# EAGLE design lightmeter_seeed1 (EAGLE 7.1.0)
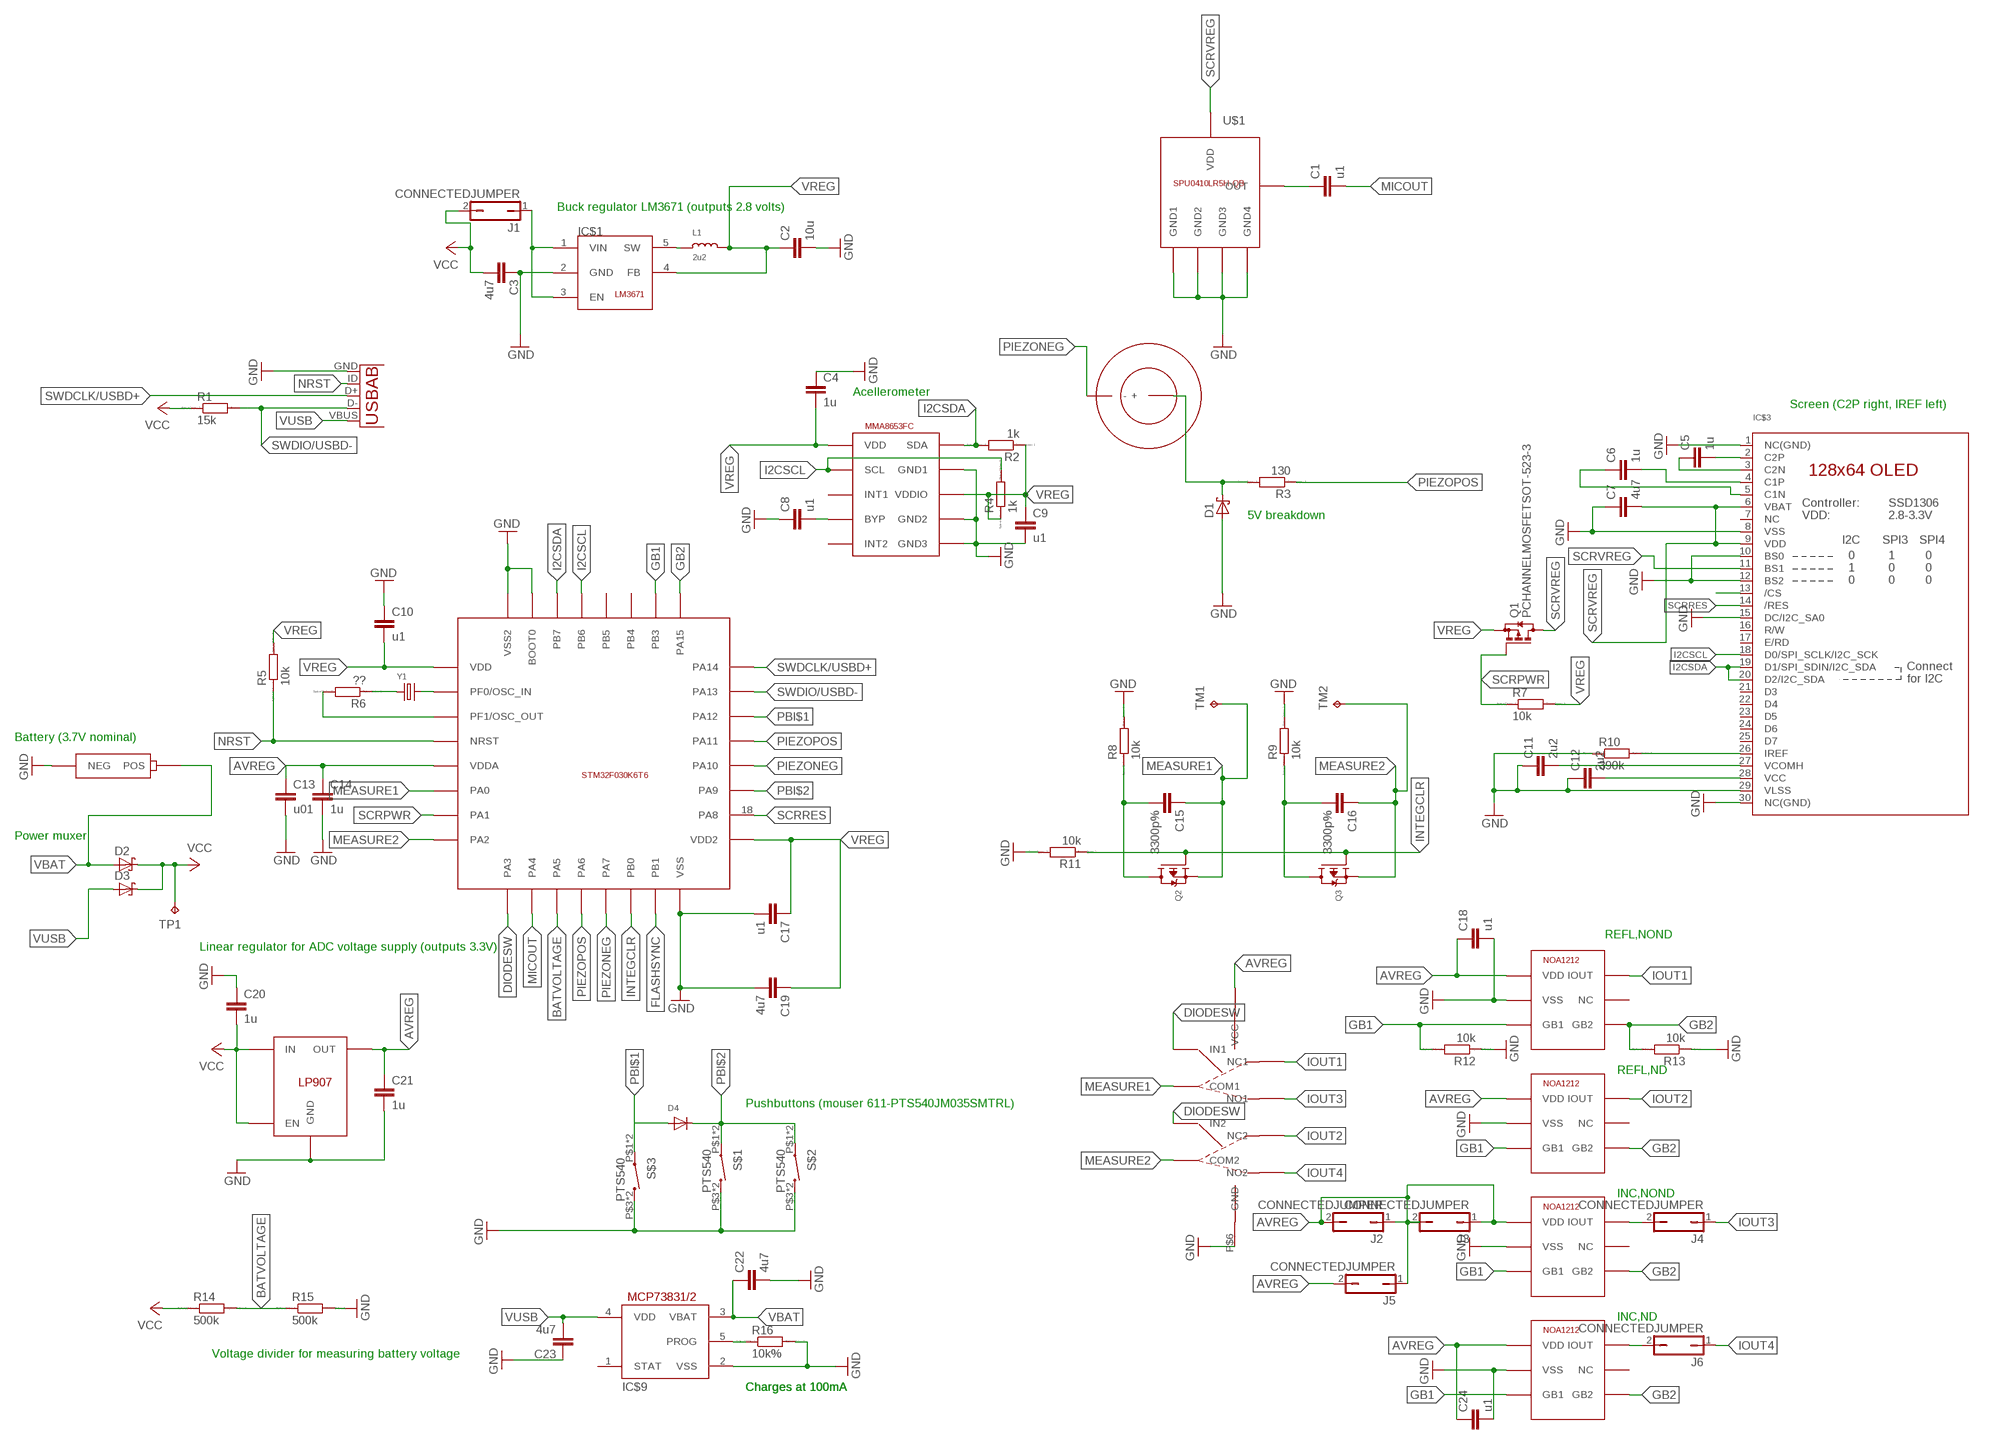
[diagram p0: schematic, sheet 1]

## Parts
C1  u1  C-EUC0402  [C0402]
C2  10u  C-EUC0402  [C0402]
C3  4u7  C-EUC0402  [C0402]
C4  1u  C-EUC0603  [C0603]
C5  1u  C-EUC0603  [C0603]
C6  1u  C-EUC0603  [C0603]
C7  4u7  C-EUC0402  [C0402]
C8  u1  C-EUC0603  [C0603]
C9  u1  C-EUC0402  [C0402]
C10  u1  C-EUC0402  [C0402]
C11  2u2  C-EUC0402  [C0402]
C12  2u2  C-EUC0402  [C0402]
C13  u01  CGAP0402  [GAP0402]
C14  1u  CGAP0402  [GAP0402]
C15  3300p%  C-EUC0603  [C0603]
C16  3300p%  C-EUC0603  [C0603]
C17  u1  C-EUC0402  [C0402]
C18  u1  C-EUC0402  [C0402]
C19  4u7  C-EUC0402  [C0402]
C20  1u  C-EUC0603  [C0603]
C21  1u  C-EUC0402  [C0402]
C22  4u7  C-EUC0402  [C0402]
C23  4u7  C-EUC0402  [C0402]
C24  u1  C-EUC0402  [C0402]
D1  SCHOTTKY-DIODESOD-929  [SOD-923]
D2  SCHOTTKY-DIODEX3-DFN0603-2  [X3-DFN0603-2]
D3  SCHOTTKY-DIODEX3-DFN0603-2  [X3-DFN0603-2]
D4  DIODESOD-323F  [SOD-323F]
IC$1  LM3671  [SOT23-5]
IC$2  MMA8653  [DFN-10]
IC$3  DISP_OLED_UG-2864HSWEG010.96"  [UG-2864HSWEG01_0.96IN_WRAPAROUND]
IC$4  STM32F030K6T6  [QFP-32]
IC$5  NOA1212  [CUDFN6]
IC$6  LP5907  [SOT23-5L]
IC$7  NOA1212  [CUDFN6]
IC$8  NOA1212  [CUDFN6]
IC$9  MCP73831/OT  [SOT23-5L]
IC$10  NOA1212  [CUDFN6]
J1  CONNECTEDJUMPER  [JUMPER_R0402]
J2  CONNECTEDJUMPER  [JUMPER_R0402]
J3  CONNECTEDJUMPER  [JUMPER_R0402]
J4  CONNECTEDJUMPER  [JUMPER_R0402]
J5  CONNECTEDJUMPER  [JUMPER_R0402]
J6  CONNECTEDJUMPER  [JUMPER_R0402]
L1  2u2  INDUCTOR_0603  [_0603]
Q1  PCHANNELMOSFETSOT-523-3  [SOT-523-3]
Q2  MOSFET-PWIDE  [SOT23-WIDE]
Q3  MOSFET-PWIDE  [SOT23-WIDE]
R1  15k  R-EU_R0402  [R0402]
R2  1k  R-EU_R0402  [R0402]
R3  130  R-EU_R0603  [R0603]
R4  1k  R-EU_R0402  [R0402]
R5  10k  R-EU_R0402  [R0402]
R6  ??  R-EU_R0402  [R0402]
R7  10k  R-EU_R0402  [R0402]
R8  10k  R-EU_R0402  [R0402]
R9  10k  R-EU_R0402  [R0402]
R10  390k  R-EU_R0402  [R0402]
R11  10k  R-EU_R0402  [R0402]
R12  10k  R-EU_R0402  [R0402]
R13  10k  R-EU_R0402  [R0402]
R14  500k  R-EU_R0402  [R0402]
R15  500k  R-EU_R0402  [R0402]
R16  10k%  R-EU_R0402  [R0402]
S$1  PTS540  [PTS540BTM]
S$2  PTS540  [PTS540BTM]
S$3  PTS540  [PTS540BTM]
TM1  TPB1,27  [B1,27]
TM2  TPB1,27  [B1,27]
TP1  TPB1,27  [B1,27]
U1  USB-ABUSB-AB-MICRO-MIDMOUNT  [USB-AB-MICRO-MIDMOUNT]
U$1  SPU0410LR5H-QBSPU0410LRSH-QB  [SPU0410LR5H-QB]
U$2  PIEZOBENDER165  [PIEZOBENDER165]
U$3  LIBAT  [78171-0002]
U$4  NLAS5223B  [WQFN10]
Y1  CRYSTAL2.5X2.0MM  [CRYSTAL_2.5X2]

## Nets
AUDIOIN: D1.P$2(C) R3.2 U$2.P$2(+)
AVREG: C13.1 C14.1 C18.1 C21.1 C24.1 IC$4.5(VDDA) IC$5.P$1(VDD) IC$6.5(OUT) IC$7.P$1(VDD) IC$8.P$1(VDD) IC$10.P$1(VDD) J2.1 J2.2 J3.1 J3.2 J5.1 J5.2 U$4.P$1(VCC)
BATVOLTAGE: IC$4.11(PA5) R14.2 R15.1
DIODESW: IC$4.9(PA3) U$4.P$4(IN1) U$4.P$8(IN2)
FLASHSYNC: IC$4.15(PB1)
GB1: IC$4.26(PB3) IC$5.P$3(GB1) IC$7.P$3(GB1) IC$8.P$3(GB1) IC$10.P$3(GB1) R12.2
GB2: IC$4.25(PA15) IC$5.P$4(GB2) IC$7.P$4(GB2) IC$8.P$4(GB2) IC$10.P$4(GB2) R13.2
GND: C2.2 C3.1 C4.1 C7.1 C8.1 C9.2 C10.1 C11.1 C12.1 C13.2 C14.2 C17.2 C18.2 C19.2 C20.1 C21.2 C22.2 C23.1 C24.2 D1.P$1(A) IC$1.2(GND) IC$2.P$6(GND3) IC$2.P$7(GND2) IC$2.P$9(GND1) IC$3.1(NC(GND)) IC$3.8(VSS) IC$3.10(BS0) IC$3.12(BS2) IC$3.15(DC/I2C_SA0) IC$3.29(VLSS) IC$3.30(NC(GND)) IC$4.16(VSS) IC$4.31(BOOT0) IC$4.32(VSS2) IC$5.P$2(VSS) IC$5.P$7(VSS) IC$6.2(GND) IC$7.P$2(VSS) IC$7.P$7(VSS) IC$8.P$2(VSS) IC$8.P$7(VSS) IC$9.2(VSS) IC$10.P$2(VSS) IC$10.P$7(VSS) R8.2 R9.2 R10.1 R11.2 R12.1 R13.1 R15.2 R16.2 S$1.P$3 S$1.P$4 S$2.P$3 S$2.P$4 S$3.P$3 S$3.P$4 U1.GND U$1.P$2(GND1) U$1.P$3(GND2) U$1.P$5(GND3) U$1.P$6(GND4) U$3.P$1(NEG) U$4.P$6(GND)
I2CSCL: IC$2.P$2(SCL) IC$3.18(D0/SPI_SCLK/I2C_SCK) IC$4.29(PB6) R4.2
I2CSDA: IC$2.P$10(SDA) IC$3.19(D1/SPI_SDIN/I2C_SDA) IC$3.20(D2/I2C_SDA) IC$4.30(PB7) R2.2
INTEGCLR: IC$4.14(PB0) Q2.1(G) Q3.1(G) R11.1
IOUT1: IC$5.P$6(IOUT) U$4.P$5(NC1)
IOUT2: IC$7.P$6(IOUT) U$4.P$7(NC2)
IOUT3: J4.1 U$4.P$2(NO1)
IOUT4: J6.1 U$4.P$10(NO2)
MEASURE1: C15.1 IC$4.6(PA0) Q2.2(S) TM1.TP U$4.P$3(COM1)
MEASURE2: C16.1 IC$4.8(PA2) Q3.2(S) TM2.TP U$4.P$9(COM2)
MICOUT: C1.2 IC$4.10(PA4)
N$1: IC$8.P$6(IOUT) J4.2
N$2: IC$10.P$6(IOUT) J6.2
N$3: C15.2 Q2.3(D) R8.1
N$4: IC$1.1(VIN) IC$1.3(EN) J1.1
N$5: IC$9.5(PROG) R16.1
N$6: C16.2 Q3.3(D) R9.1
N$7: C8.2 IC$2.P$4(BYP)
N$8: IC$4.2(PF0/OSC_IN) Y1.3
N$9: IC$4.3(PF1/OSC_OUT) R6.2
N$10: IC$1.5(SW) L1.1
N$11: R6.1 Y1.1
N$12: C11.2 IC$3.27(VCOMH)
N$14: C1.1 U$1.P$1(OUT)
N$15: C5.2 IC$3.2(C2P)
N$16: C5.1 IC$3.3(C2N)
N$19: IC$3.26(IREF) R10.2
N$24: C6.1 IC$3.5(C1N)
N$27: C6.2 IC$3.4(C1P)
N$30: C12.2 IC$3.28(VCC)
NRST: IC$4.4(NRST) R5.1 U1.ID(USBID)
PBI$1: D4.A IC$4.22(PA12) S$3.P$1 S$3.P$2
PBI$2: D4.C IC$4.19(PA9) S$1.P$1 S$1.P$2 S$2.P$1 S$2.P$2
PIEZONEG: IC$4.13(PA7) IC$4.20(PA10) U$2.P$1(-)
PIEZOPOS: IC$4.12(PA6) IC$4.21(PA11) R3.1
SCRCS: IC$3.13(/CS)
SCRPWR: IC$4.7(PA1) Q1.P$2(G) R7.1
SCRRES: IC$3.14(/RES) IC$4.18(PA8)
SCRVREG: C7.2 IC$3.6(VBAT) IC$3.9(VDD) IC$3.11(BS1) Q1.P$1(D) U$1.P$4(VDD)
SWDCLK/USBD+: IC$4.24(PA14) U1.D+
SWDIO/USBD-: IC$4.23(PA13) R1.2 U1.D-
VBAT: C22.1 D2.P$1(A) IC$9.3(VBAT) U$3.P$2(POS)
VCC: C3.2 C20.2 D2.P$2(C) D3.P$2(C) IC$6.1(IN) IC$6.3(EN) J1.2 R1.1 R14.1 TP1.TP
VREG: C2.1 C4.2 C9.1 C10.2 C17.1 C19.1 IC$1.4(FB) IC$2.P$1(VDD) IC$2.P$8(VDDIO) IC$4.1(VDD) IC$4.17(VDD2) L1.2 Q1.P$3(S) R2.1 R4.1 R5.2 R7.2
VUSB: C23.2 D3.P$1(A) IC$9.4(VDD) U1.VBUS
Unconnected: IC$2.P$3(INT1) IC$2.P$5(INT2) IC$3.7(NC) IC$3.16(R/W) IC$3.17(E/RD) IC$3.21(D3) IC$3.22(D4) IC$3.23(D5) IC$3.24(D6) IC$3.25(D7) IC$4.27(PB4) IC$4.28(PB5) IC$5.P$5(NC) IC$7.P$5(NC) IC$8.P$5(NC) IC$9.1(STAT) IC$10.P$5(NC)

## Notes on the sheet
- Buck regulator LM3671 (outputs 2.8 volts)
- Acellerometer
- Screen (C2P right, IREF left)
- 5V breakdown
- Battery (3.7V nominal)
- Power muxer
- REFL,NOND
- Linear regulator for ADC voltage supply (outputs 3.3V)
- REFL,ND
- Pushbuttons (mouser 611-PTS540JM035SMTRL)
- INC,NOND
- INC,ND
- Voltage divider for measuring battery voltage
- Charges at 100mA | Charges at 100mA

## Library data of the parts
C1-C12 C15-C24 = rcl:C-EU: CAPACITOR, European symbol
C13 C14 = lightmeter:C: CAPACITOR naming: grid - package width
D1-D3 = lightmeter:SCHOTTKY-DIODE: Schottky Diode
D4 = adafruit:DIODE: Diode SMADIODE - SMA Surface Mount Package 20V 1A Schottky Diode Digikey: 641-1014-6-ND DO-1N4148 - Through Hole Small Current Diode SOD-123 20V 1 A (.5mV Vf) Schottky Diode - Digikey: MBRX120TPMSCT-ND SOD-323 10V 570mA (.38mV Vf, 3ns) Schottky Diode - Digikey: ZLLS410CT-ND SOD-523 30V 30mA Schottky Diode (RB751S-40TE61) - Digikey: RB751S-40TE61CT-ND SOT23-R/W - SOT23 Package (R = Solder Paste/Reflow Ovens, W = Hand-Soldering) BAT54Film 40V 300mA - Digikey: 497-7162-1-ND
IC$1 = lightmeter:LM3671
IC$2 = lightmeter:MMA8653
IC$3 = microbuilder:DISP_OLED_UG-2864HSWEG01: UG-2864HSWEG01 OLED display Both 1.3" and 0.96" models share the same FPC tab footprint, only the screen dimensions vary.
IC$4 = lightmeter:STM32F030K6T6
IC$5 IC$7 IC$8 IC$10 = lightmeter:NOA1212
IC$6 = lightmeter:LP5907
IC$9 = adafruit:MCP73831: MCP73831/2 Miniature Single-Cell, Fully Integrated Li-Ion, Li-Polymer Charge Management Controllers. Nice and small simple lipoly charge controller, with adjustable current and status output (LED) http://www.ladyada.net/library/pcb/eaglelibrary.html
J1-J6 = lightmeter:CONNECTEDJUMPER
L1 = microbuilder:INDUCTOR: Inductors 0603: 10nH Ceramic Inductor - microwire antenna/RF (Digikey: 712-1434-2-ND) 0805: 560nH Ceramic Inductor - RF (Digikey: 553-1047-1-ND) 270nH Ceramic Inductor - Q = 40@250MHz, +-5%, 1 Ohm DC Resistance (Digikey: 535-10506-2-ND) 1007 (2518 Metric) SMT: 10µH 10% 250mOhm 820mA 1007 Inductor (Digikey: 587-2189-1-ND) 22µH 10% 500mOhm 580mA 1007 Inductor (Digikey: 587-2190-1-ND) 47µH 10% 950mOhm 420mA 1007 Inductor (Digikey: 587-2191-1-ND) 47µH 5% 100mOhm 1A 1008 Inductor (Digikey: 732-1816-1-ND) 5.0x5.0mm (Taiyo Yuden NR5040 Series) 6.8µH 20% 2.3A 64mOhm Inductor (Digikey: 587-2374-2-ND) 5.0x5.0mm (TDK VLC5045 Series) 4.7µH 20% 3.3A 34mOhm Inductor (Digikey: 445-6526-1-ND) 6.8µH 20% 2.7A 46mOhm Inductor (Digikey: 445-6527-1-ND) 6.0x6.0mm (TDK VLC6045 Series) 4.7µH 20% 3.8A 27mOhm Inductor (Digikey: 445-6538-2-ND) 6.8µH 20% 3A 41mOhm Inductor (Digikey: 445-6540-1-ND) 6.2µH 30% 2.2A 45mOhm Inductor (Digikey: SRR5028-6R2YCT-ND) - Not TDK VLC6045 but footprint should match 6.0x6.0mm (TDK SLF6045 Series) 6.8uH 30% 2A 33mOhm Inductor (Digikey: 445-4572-1-ND, Mouser: 810-SLF645T6R8N2R0PF)
Q1 = lightmeter:PCHANNELMOSFET
Q2 Q3 = microbuilder:MOSFET-P: P-Channel Mosfet LEGEND VDS: Voltage Drain-Source ID: Drain Current RDS(ON): Drain-Source On-State Resistance VGS(TH): Gate-Source Threshold Voltage CISS: Drain-Source Input Capacitance SOT-23 Name VDS ID RDS(ON) VGS(TH) CISS Order Number IRLML5103 30V 760mA 600 mOhm -- 75pF @ 25V Digikey: IRLML5103PBFCT-ND IRLML6401 12V 4.3A 50 mOhm 950mV @ 250µA 830pF @ 10V Digikey: IRLML6401PBFTR-ND NTR0202PL 20V 400mA 800 mOhm 2.3V @ 250uA 70pF @ 5V Digikey: NTR0202PLT1GOSTR-ND NTR4101PT1G 20V 1.8A 85 mOhm 1.2V @ 250uA 675pF @ 10V Digikey: NTR4101PT1GOSCT-ND DMP2004K 20V 600mA 900 mOhm 1V @ 250uA 175pF @ 16V Digikey: DMP2004KDICT-ND PMV65XP 20V 3.9A 76 mOhm 950mV @ 1mA 725pF @ 20V Digikey: 568-2358-2-ND TO-252 Name VDS ID RDS(ON) VGS(TH) CISS Order Number AOD417 30V 25A 34 mOhm 3V @ 250µA 920pF @ 15V Digikey: 785-1106-2-ND
R1-R16 = resistor:R-EU_: RESISTOR, European symbol; SPICEPREFIX: R
S$1-S$3 = lightmeter:PTS540
TM1 TM2 TP1 = testpad:TP: Test pad
U1 = lightmeter:USB-AB: This is a USB AB connector that is compatible with USB OTG. i.e. this connector can serve as a host or device
U$1 = lightmeter:SPU0410LR5H-QB
U$2 = lightmeter:PIEZOBENDER165
U$3 = lightmeter:LIBAT
U$4 = lightmeter:NLAS5223B
Y1 = microbuilder:CRYSTAL: Crystals HC49UP - Surface Mount Crystal 4.0MHz 18pF +/-30ppm Surface Mount Crystal [Digikey: 535-9857-1-ND] 12.0 MHz Surface Mount Crystal [Digikey: 535-9869-6-ND] 25.0 MHz Surface Mount Crystal [Digikey: 535-9078-1-ND] 2.5 x 2.0mm - MEMs SMT Crystal 16.0 MHz 10pF 20ppm 2.5 x 2.0mm Crystal [Digikey -40-85°C: 535-10923-1-ND] 3.2 x 2.5mm - MEMs SMT Crystal 12.0 MHz 8pF 15ppm 3.2 x 2.5mm Crystal [Digikey: -10-70°C: 644-1047-1-ND -40-125°C: 644-1128-1-ND] 16.0 MHz 8pF 15ppm 3.2 x 2.5mm Crystal [Digikey: -10-70°C: 644-1049-1-ND -40-125°C: 644-1129-2-ND] 16.0 MHz 10pF 10ppm 3.2 x 2.5mm Crystal [Digikey: 644-1100-1-ND] 27.12 MHz 18pF 30ppm 3.2 x 2.5mm Crystal [Digikey: 887-1424-1-ND] 27.12MHz 10pF 10ppm 3.2 x 2.5mm Crystal [Digikey: 887-1329-1-ND] 4.9 x 1.8mm - MEMs SMT Crystal 32.768 KHz 12.5pF 20ppm 4.9 x 1.8mm Crystal [Digikey: SE2415CT-ND] 8.0 x 3.8mm - Surface Mount Crystal 32.768kHz 12.5pF 20ppm -40°C-85°C [Digikey: 535-9166-2-ND] Cylinder 32.768KHz Cylinder Crystal (2x6mm body) [Ex. Digikey: 300-8341-2-ND]

## Board
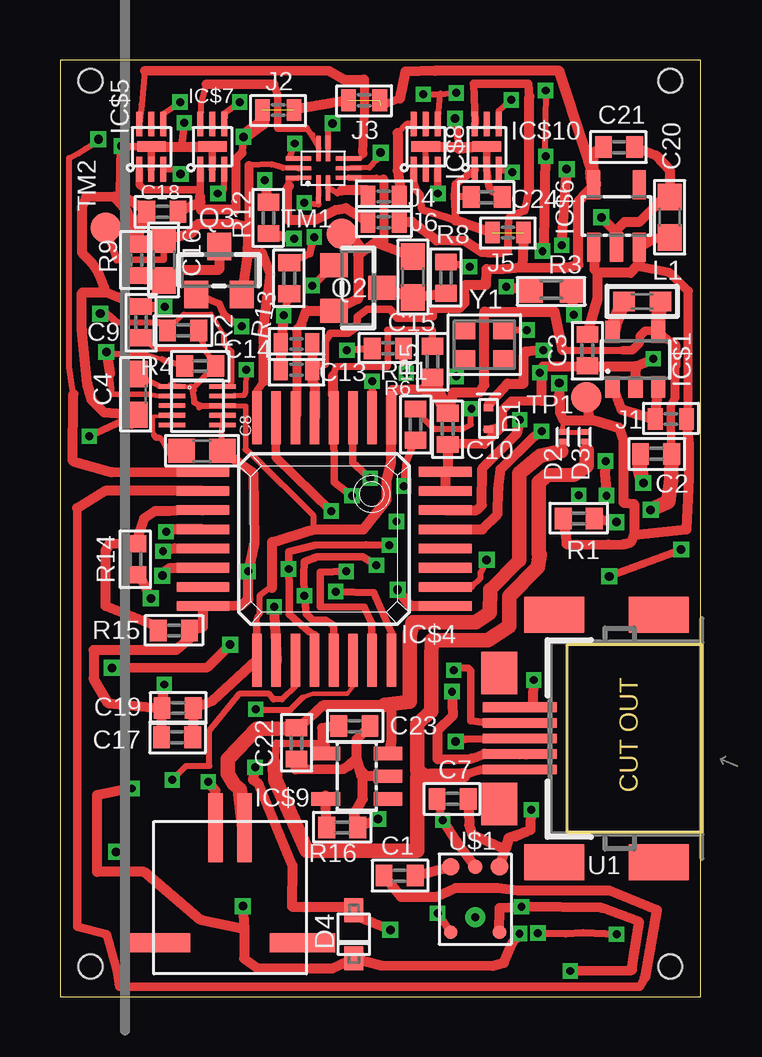
[diagram p1: board, top side]
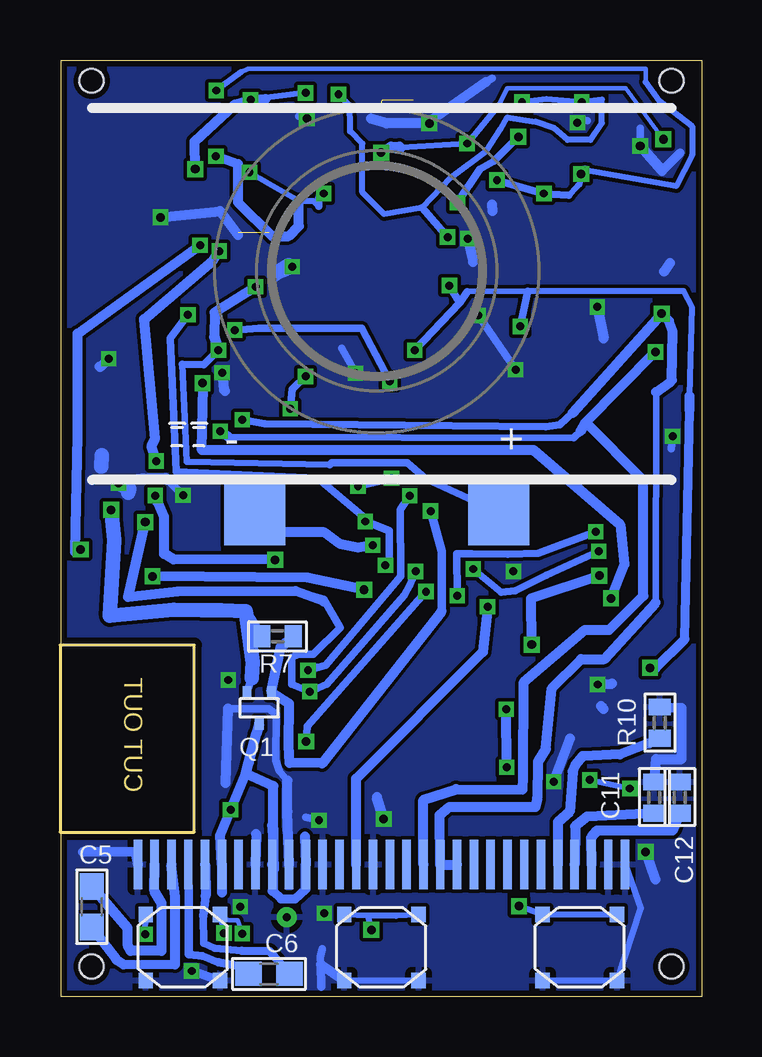
[diagram p2: board, bottom side, seen from below]

Size 26.74 x 39.04 mm. Coordinates in mm from the lower left corner, seen from the top.
Outline: 0,0 26.7,0 26.7,39.04 0,39.04 0,0
Copper layers (1*16): Top 0.035mm / dielectric 1.5mm / Bottom 0.035mm
Design rules "SeeedStudio_2layer_DRU_no_angle_20140221": minimum track width 6mil, minimum drill 12mil, track to track 6mil, track to pad 6mil, pad to pad 6mil, via to via 6mil, smd to smd 0mil, copper to edge 10mil, drill to drill 10mil, minimum pad ring 10mil, minimum via ring 6mil, stop-mask expansion 2mil, vias tented up to drill 100mil, thermal gap 10mil
Holes 1 mm at 25.43,38.18 25.43,1.27 1.27,1.27 1.27,38.18

### Footprints (pad centres in the part's own frame; a part is rotated, then mirrored left to right if it is on the bottom)
C0402 = smd 0.7 x 0.9: 1 -0.65,0; 2 0.65,0
C0603 = smd 1.1 x 1: 1 -0.85,0; 2 0.85,0
GAP0402 = smd 0.584 x 0.9: 1 -0.65,0; 2 0.65,0
SOD-923 = smd 0.3 x 0.4: P$1 -0.45,0; P$2 0.45,0
X3-DFN0603-2 = smd 0.229 x 0.3: P$1 -0.19,0; P$2 0.19,0
SOD-323F = smd 1 x 0.8: A -1,0; C 1,0
SOT23-5 = smd 0.6 x 0.9: 1 -0.95,-1.15; 2 0,-1.15; 3 0.95,-1.15; 4 0.95,1.15; 5 -0.95,1.15
DFN-10 = smd 0.191 x 1.099: P$1 -0.8,-1.048; P$2 -0.4,-1.048; P$3 0,-1.048; P$4 0.4,-1.048; P$5 0.8,-1.048; P$6 0.8,1.048; P$7 0.4,1.048; P$8 0,1.048; P$9 -0.4,1.048; P$10 -0.8,1.048
UG-2864HSWEG01_0.96IN_WRAPAROUND = smd 0.35 x 2.057 bottom: 1 -10.15,-1.2; 2 -9.45,-1.2; 3 -8.75,-1.2; 4 -8.05,-1.2; 5 -7.35,-1.2; 6 -6.65,-1.2; 7 -5.95,-1.2; 8 -5.25,-1.2; 9 -4.55,-1.2; 10 -3.85,-1.2; 11 -3.15,-1.2; 12 -2.45,-1.2; 13 -1.75,-1.2; 14 -1.05,-1.2; 15 -0.35,-1.2; 16 0.35,-1.2; 17 1.05,-1.2; 18 1.75,-1.2; 19 2.45,-1.2; 20 3.15,-1.2; 21 3.85,-1.2; 22 4.55,-1.2; 23 5.25,-1.2; 24 5.95,-1.2; 25 6.65,-1.2; 26 7.35,-1.2; 27 8.05,-1.2; 28 8.75,-1.2; 29 9.45,-1.2; 30 10.15,-1.2
QFP-32 = smd 0.4 x 2.2: 1 -2.4,-4.65; 2 -1.6,-4.65; 3 -0.8,-4.65; 4 0,-4.65; 5 0.8,-4.65; 6 1.6,-4.65; 7 2.4,-4.65; 8 3.2,-4.65; 17 3.2,5.45; 18 2.4,5.45; 19 1.6,5.45; 20 0.8,5.45; 21 0,5.45; 22 -0.8,5.45; 23 -1.6,5.45; 24 -2.4,5.45 | smd 2.2 x 0.4: 9 5.45,-2.4; 10 5.45,-1.6; 11 5.45,-0.8; 12 5.45,0; 13 5.45,0.8; 14 5.45,1.6; 15 5.45,2.4; 16 5.45,3.2; 25 -4.65,3.2; 26 -4.65,2.4; 27 -4.65,1.6; 28 -4.65,0.8; 29 -4.65,0; 30 -4.65,-0.8; 31 -4.65,-1.6; 32 -4.65,-2.4
CUDFN6 = smd 0.25 x 1.028: P$1 -0.5,-0.944; P$2 0,-0.944; P$3 0.5,-0.944; P$4 0.5,0.944; P$5 0,0.944; P$6 -0.5,0.944 | smd 1.2 x 0.432: P$7 0,0
SOT23-5L = smd 0.55 x 1.2: 1 -0.95,-1.3; 2 0,-1.3; 3 0.95,-1.3; 4 0.95,1.3; 5 -0.95,1.3
JUMPER_R0402 = smd 0.61 x 0.9: 1 -0.65,0; 2 0.65,0
_0603 = smd 0.9 x 0.8: 1 -0.762,0; 2 0.762,0
SOT-523-3 = smd 0.356 x 0.508: P$1 0,0.648; P$2 -0.511,-0.648; P$3 0.511,-0.648
SOT23-WIDE = smd 1 x 1.143: 1 -0.95,-1; 2 0.95,-1; 3 0,1
R0402 = smd 0.7 x 0.9: 1 -0.65,0; 2 0.65,0
R0603 = smd 1 x 1.1: 1 -0.85,0; 2 0.85,0
PTS540BTM = smd 0.6 x 0.65 bottom: P$1 -1.55,1.375; P$2 1.55,1.375; P$3 -1.55,-1.375; P$4 1.55,-1.375
B1,27 = smd 1.27 x 1.27: TP 0,0
USB-AB-MICRO-MIDMOUNT = smd 3.079 x 0.4: D+ 4.168,0; D- 4.168,0.65; GND 4.168,-1.3; ID 4.168,-0.65; VBUS 4.168,1.3 | smd 2.5 x 1.5: P$1 -1.625,-5.15; P$2 -1.625,5.15; P$6 2.725,5.15; P$7 2.725,-5.15 | smd 1.5 x 1.778: P$3 5.01,2.733; P$4 5.01,-2.733
SPU0410LR5H-QB = smd 0.723 x 0.723: P$1 -1.015,2.103; P$4 1.015,2.103 | smd 0.562 x 0.562: P$2 -1.015,-0.634; P$3 1.015,-0.634 | smd 0.612 x 0.612: P$5 0,2.103 | drill 0.33: P$6 0,0
PIEZOBENDER165 = smd 2.54 x 2.54 bottom: P$1 -5.08,10.16; P$2 5.08,10.16
78171-0002 = smd 0.6 x 2.882: P$1 -0.6,2.904; P$2 0.6,2.904 | smd 2.732 x 0.8: P$300 -3.02,-1.887; P$400 3.02,-1.887
WQFN10 = smd 1.171 x 0.178: P$1 -0.874,0.199 | smd 1.069 x 0.178: P$2 -0.823,-0.199; P$6 0.823,-0.199; P$7 0.823,0.199 | smd 0.178 x 1.069: P$3 -0.399,-1.041; P$4 0,-1.041; P$5 0.399,-1.041; P$8 0.399,1.041; P$9 0,1.041 | smd 0.178 x 1.059: P$10 -0.399,1.041
CRYSTAL_2.5X2 = smd 0.9 x 0.8: 1 -0.825,-0.625; 2 0.825,-0.625; 3 0.825,0.625; 4 -0.825,0.625

### Placement (x,y rotation side)
C1  14.15,5.05 180 top
C2  24.84,22.63 180 top
C3  21.97,26.95 90 top
C4  3.15,25.11 90 top
C5  25.41,3.76 90 bottom
C6  18.03,0.97 180 bottom
C7  16.36,8.25 0 top
C8  5.92,22.76 180 top
C9  3.38,28.12 90 top
C10  16.15,23.67 90 top
C11  1.98,8.31 270 bottom
C12  0.91,8.31 270 bottom
C13  9.86,26.14 180 top
C14  9.86,27.2 180 top
C15  14.71,30 270 top
C16  4.32,30.71 270 top
C17  4.88,10.82 180 top
C18  4.27,32.72 180 top
C19  4.9,12.04 180 top
C20  25.4,32.49 270 top
C21  23.29,35.41 0 top
C22  9.86,10.57 270 top
C23  12.27,11.28 180 top
C24  17.78,33.32 0 top
D1  17.86,24.1 90 top
D2  20.96,23.34 90 top
D3  21.87,23.34 90 top
D4  12.24,2.62 270 top
IC$1  23.98,26.57 0 top
IC$2  5.71,24.64 270 top
IC$3  13.35,4.32 180 top
IC$4  11.4,19.48 180 top
IC$5  3.81,35.43 0 top
IC$6  23.19,32.54 0 top
IC$7  6.35,35.43 0 top
IC$8  15.24,35.43 0 top
IC$9  12.37,9.19 90 top
IC$10  17.78,35.43 0 top
J1  25.45,24.08 0 top
J2  9.09,36.96 180 top
J3  12.67,37.36 180 top
J4  13.49,33.35 0 top
J5  18.67,31.85 180 top
J6  13.49,32.28 0 top
L1  24.26,28.98 0 top
Q1  18.44,12.04 180 bottom
Q2  12.42,29.54 270 top
Q3  6.63,30.28 0 top
R1  21.62,19.94 0 top
R2  5.13,27.77 180 top
R3  20.47,29.48 180 top
R4  5.84,26.29 180 top
R5  15.52,26.47 270 top
R6  14.81,23.85 270 top
R7  17.68,15.03 180 bottom
R8  16.08,29.97 90 top
R9  3.18,30.71 90 top
R10  1.75,11.43 270 bottom
R11  13.67,27.03 0 top
R12  8.69,32.46 90 top
R13  9.55,29.95 90 top
R14  3.15,18.24 90 top
R15  4.75,15.27 0 top
R16  11.76,7.06 0 top
S$1  5.08,2.06 0 top
S$2  21.62,2.06 0 top
S$3  13.35,2.06 0 top
TM1  11.73,31.8 0 top
TM2  1.9,32.05 0 top
TP1  21.92,24.99 0 top
U1  23.32,10.77 180 top
U$1  17.3,3.33 0 top
U$2  13.54,30.25 180 top
U$3  7.09,4.14 0 top
U$4  10.97,34.53 90 top
Y1  17.68,27.18 0 top

### Tracks (layer width: path | path; a pad name or v marks a point on that pad's centre or on a via)
AUDIOIN  (via drill 0.33)
  Top 0.305: D1.P$2 17.88,24.71
  Top 0.406: v20.14,26.95 19.36,26.87 19.32,26.65 19.32,25.55 18.64,25.55 17.88,24.71 | v18.59,29.59 R3.2
  Bottom 0.267: 15.49,22.18 21.46,22.31 21.64,26.37
  Bottom 0.305: 21.64,26.37 20.75,26.34 v20.14,26.95 | 15.49,22.18 15.42,22.25 12.27,22.25 11.51,21.59 8.46,20.19
  Bottom 0.406: 8.46,20.19 U$2.P$2 | v18.59,29.59 20.3,28.52 20.32,27.51 v20.14,26.95
AVREG  (via drill 0.33, 0.36)  (4 unrouted)
  Top 0.229: 10.77,33.02 U$4.P$1
  Top 0.254: v10.18,33.1 10.77,33.02
  Top 0.305: 5.84,33.35 5.84,33.66 | 5.84,33.66 5.84,34.48 IC$7.P$1 | IC$5.P$1 3.31,33.85 3.53,33.63 5.82,33.63 5.84,33.66 | IC$10.P$1 17.3,34.47 16.46,33.86 16.43,33.37 | 13.39,37.13 14.17,37.44 | 16.43,33.37 16.48,32.36 15.09,32.79 15.06,32.89 15.01,33.43 14.83,33.6 14.74,33.93 IC$8.P$1 | v7.64,35.84 7.58,35.17 | C24.1 16.43,33.37 | 10.62,26.26 11.05,26.37 11.05,27.28 11.25,27.66 12.01,27.66 12.37,27.92 12.39,28.35 12.8,28.65 13.77,28.65 14.05,28.27 15.24,28.27 15.55,28.35 15.55,28.63 15.57,28.65 16.66,28.65 16.92,28.91 16.89,29.67
  Top 0.381: 7.58,35.17 7.33,34.9 7.32,33.15 7.32,32.79 | 5.87,32.79 5.85,33.13
  Top 0.406: C21.1 22.24,35.21 IC$6.5 21.6,33.15 21.6,30.51 21.06,30.39 19.27,30.4 | 7.32,32.79 5.87,32.79 | 5.84,33.35 5.85,33.13 C18.1 | 14.17,37.44 14.4,38.56 15.62,38.58 20.8,38.58 22.19,34.39 22.1,34.1 | IC$4.5 10.62,24.14 10.62,25.5 10.53,25.59 C13.1 | 10.62,26.26 10.53,26.4 C13.1 | 16.89,29.67 17.75,29.68 17.78,30.33 18.47,30.34 19.27,30.4 | J3.2 J2.1 | J5.2 16.48,32.36 | J5.1 19.27,30.4 | C14.1 C13.1
  Top 0.559: 8.43,36.42 J2.2
  Top 0.61: IC$6.5 22.19,34.39 | 8.43,36.42 v7.64,35.84
  Bottom 0.305: v10.18,33.1 9.25,34.49 8.66,34.82 v7.64,35.84
BATVOLTAGE
  Top 0.305: 4.85,20.27 5.94,20.27
  Top 0.406: 5.94,20.27 IC$4.11 | R15.1 4.07,15.43 1.9,16.28 1.9,18.59 2.09,18.9 R14.2 3.51,19.94 3.96,20.26 4.57,20.26 4.85,20.27
DIODESW  (via drill 0.33, 0.36)
  Top 0.203: U$4.P$8 9.58,34.95
  Top 0.229: 12.9,34.57 12.13,34.54 U$4.P$4
  Top 0.254: v13.36,35.18 13.21,34.87 12.9,34.57 | 9.58,34.95 v9.78,35.56 | 0.56,25.12 0.38,26.24 0.38,34.95 0.76,35.15 1.09,35.36 1.55,35.64 v1.6,35.74
  Top 0.406: 0.56,25.12 0.53,22.33 2.16,21.87 IC$4.9
  Bottom 0.178: v1.6,35.74 3.18,37.87 8.1,37.87 8.46,37.16
  Bottom 0.254: 12.55,35.38 v9.78,35.56 8.46,37.16
  Bottom 0.406: v13.36,35.18 12.95,35.43 12.6,35.43 12.55,35.38
GB1  (via drill 0.33, 0.36)
  Top 0.254: IC$5.P$3 4.83,34.49 v5.03,34.29 | IC$10.P$3 18.53,34.43 v18.85,34.37 | IC$7.P$3 6.83,33.62 v6.58,33.48 | IC$4.26 17.16,17.08 17.53,17.45 17.53,17.68 v17.78,18.21 | v20.23,37.77 20.19,35.08 v20.24,35.03
  Top 0.305: v15.75,33.48 15.75,34.48 IC$8.P$3
  Top 0.406: v22.73,22.33 22.71,21.79 v22.77,20.89 | v20.1,31.08 20.17,31.47 v20.24,35.03 | R12.2 v8.53,34.04
  Bottom 0.178: 19.2,38.53 18.9,38.68 2.34,38.68 2.34,38.12
  Bottom 0.254: v5.03,34.29 5.11,33.86 5.18,33.78 5.54,33.4 | v18.85,34.37 16.79,33.17 16.18,33.17 15.95,32.94 | 4.88,34.44 1.07,33.78 0.41,35.08 0.41,36.27 1.75,37.31 2.34,38.12 | 19.2,38.53 v20.23,37.77
  Bottom 0.305: 15.95,32.94 15.95,33.3 v15.75,33.48 | 5.54,33.4 v6.58,33.48 v8.53,34.04
  Bottom 0.406: 16.79,33.17 16.79,32.13 17.22,31.7 17.91,31.7 19.33,33.12 19.33,34.7 v20.24,35.03 | v17.78,18.21 22.02,18.24 22.4,18.47 22.4,20.02 v22.77,20.89 22.71,20.62 | v20.1,31.08 20.37,30.68 23.24,28.25 22.78,23.27 22.94,22.94 v22.73,22.33 | 4.88,34.44 v5.03,34.29
GB2  (via drill 0.33, 0.36)
  Top 0.254: IC$5.P$4 4.31,36.8 v5,37.29 | v7.49,37.29 6.86,36.83 IC$7.P$4 | IC$10.P$4 18.28,36.91 v18.8,37.38 | 15.72,36.39 IC$8.P$4 15.85,37.64 15.85,37.62 | v15.14,37.62 15.85,37.62 | 15.85,37.62 v16.51,37.67
  Top 0.305: R13.2 10.41,30.96 10.46,31.27 v10.59,31.66 | v22.89,17.53 v25.88,18.64
  Top 0.406: IC$4.25 14.61,16.28 v14.07,16.97 | v20.9,31.32 v21.11,34.49
  Bottom 0.254: v7.49,37.29 6.48,37.41 v5,37.29 4.17,37.39 4.17,36.42 4.65,35.71 5.59,35.71 6.15,36.2 6.93,36.47 8.1,36.65 8.38,36.17 8.99,35.23 10.46,34.14 11.66,32.89 13.23,32.61 14.15,33.53 14.15,35.56 14.66,36.07 14.66,36.55 14.68,37.16 v15.14,37.62 | v16.51,37.67 v18.8,37.38
  Bottom 0.305: v10.59,31.66 11.66,32.89
  Bottom 0.406: v14.07,16.97 16.43,17.48 v22.89,17.53 | v25.88,18.64 26.11,18.54 26.01,23.42 26.01,27.64 v20.9,31.32 | 18.19,37.41 v18.8,37.38 19.46,37.19 21.13,35.64 v21.11,34.49
GND  (via drill 0.33, 0.36)
  Top 0.203: IC$2.P$7 IC$2.P$6
  Top 0.229: IC$2.P$9 7.68,25.06 7.73,25.25 v7.76,26.14
  Top 0.254: IC$8.P$2 IC$8.P$7 | IC$10.P$2 IC$10.P$7 | C4.1 3,23.8 | C8.1 6.75,23.21 IC$2.P$6 6.75,23.67 | U$4.P$6 11.18,36.14 v11.35,36.4
  Top 0.305: IC$5.P$2 IC$5.P$7 | v16.46,36.6 16.51,36.73 16.61,35.28 17.75,35.41 17.78,35.38 IC$10.P$2 17.86,33.78 18.01,33.58 C24.2 | IC$7.P$7 IC$7.P$2 6.35,35.33 6.3,35.38 3.45,35.38 3.4,35.43 2.59,35.43 v2.56,35.46 | 5.08,35.43 v5.18,36.42 | R8.2 v17.07,30.43 | R11.2 14.3,26.14 v14.43,25.98 | R13.1 v9.32,28.4 | D1.P$1 17.77,23.63 | 17.77,23.63 18.22,23.58 | U$1.P$2 v15.73,3.48 | 18.44,23.8 17.77,23.63 | C4.1 v1.22,23.37 | C7.1 v15.95,7.37
  Top 0.356: C3.1 23.94,26.26 24,26.06 23.98,25.55 IC$1.2
  Top 0.381: 18.44,23.8 18.44,24.47 18.82,24.83 20.07,24.83
  Top 0.406: IC$4.31 IC$4.32 16.15,21.98 C10.1 17.69,23.05 18.44,23.8 | IC$5.P$7 5.08,35.43 IC$7.P$7 | C21.2 24.84,35.05 25.43,34.42 C20.1 24.98,33.14 24.13,32.28 23.52,32.28 23.22,31.98 23.22,31.26 IC$6.2 23.19,31.85 v22.55,32.49 | 12.55,9.22 12.62,9.35 12.62,8.25 12.26,7.61 R16.2 v13.26,7.42 | 12.55,9.22 13.39,9.22 IC$9.2 | C23.1 12.94,11.32 12.34,10.72 12.34,9.93 | 12.34,9.93 12.55,9.22 | C22.2 9.82,9.48 11.81,9.5 12.04,9.63 12.34,9.93 | 23.94,26.26 20.13,26.26 v19.99,26.01 20.07,25.93 20.07,24.83 | IC$8.P$7 IC$10.P$7 | U1.GND 19.71,12.06 19.71,12.32 v19.74,13.21 | IC$1.2 24,26.29 v24.71,26.59 | v4.36,28.75 C9.2 1.93,29.36 | 1.93,29.36 0.94,29.36 0.91,29.34 0.91,27.81 1.14,25.55 1.35,24.84 1.82,24.37 C4.1 | C19.2 2.01,12.24 1.4,13.26 1.4,14.45 4.83,14.45 5.4,14.95 R15.2 5.96,15.41 IC$4.16 7.54,16.31 7.85,16.59 v7.85,17.73 8.1,18.92 8.05,21.84 C8.1 | C19.2 v4.34,13.02 | C14.2 C13.2 v9.32,28.4 | C17.2 C19.2 | C18.2 2.54,33.45 v2.56,35.46 | R12.1 v9.75,31.6 | U$3.P$1 6.48,8.61 v6.17,8.97 | U$1.P$5 16.52,6.5 v15.95,7.37 | U$1.P$3 18.31,3.71 v19.23,3.76 22.58,3.71 24.13,3.12 23.93,1.83 23.82,1.12 v21.26,1.08 | 1.93,29.36 1.6,30.15 | 1.6,30.15 1.58,30.23 | R9.2 2.79,32.74 2.29,33.35 1.09,33.33 0.91,32.92 0.91,31.01 1.32,30.58 1.6,30.15
  Top 0.61: C2.2 24.17,22 v24.31,21.41 | R9.2 3.2,31.93 C18.2
  Bottom 0.254: v11.35,36.4 11.28,36.52 | S$3.P$3 S$3.P$4 | S$1.P$4 S$1.P$3 2.54,3.68 IC$3.30 | v15.73,3.48 15.75,3.49
  Bottom 0.305: v7.76,26.14 v9.32,28.4 | v16.46,36.6 16.43,36.7 16.79,36.7 | v5.18,36.42 4.95,36.55 4.78,36.5 | 18.57,5.3 IC$3.8 | v2.56,35.46 2.56,36.2 | 19.74,12.01 18.03,12.01 17.73,11.79 17.75,9.86 17.6,9.42 17.27,9.02 | 15.88,1.35 15.89,1.66 15.82,2.01 | 8.74,38.28 8.99,38.12 | v14.43,25.98 15.01,27.03 | v15.95,7.37 16.51,7.49 | v1.22,23.37 1.27,22.84
  Bottom 0.343: v21.62,20.9 22.35,21.62
  Bottom 0.356: 15.85,0.43 15.88,1.35 | 0.89,35.18 1.65,34.42 | 4.2,12.12 4.15,12.12 | S$2.P$3 v21.26,1.08
  Bottom 0.406: 4.09,12 4.2,12.12 | v22.55,32.49 20.07,32.74 19.33,31.75 | v19.99,26.01 19.91,25.3 19.86,25.25 | v24.71,26.59 25.07,26.24 25.09,26.26 | S$3.P$4 15.88,1.35 | 18.57,6.78 IC$3.8 | v13.26,7.42 13.54,8.33 | 25.78,6.04 23.6,6.07 IC$3.1 | IC$3.10 17.27,7.72 17.27,9.02 | 19.84,8.91 19.74,12.01 | 1.65,34.42 v2.56,35.46 | v2.34,6.04 1.93,4.9 | C11.1 1.9,9.91 0.84,9.91 0.84,12.04 R10.1 | v4.36,28.75 4.09,27.43 | v4.34,13.02 3.73,13.06 | 22.35,21.62 23.39,21.59 v24.31,21.41 | 8.99,38.12 11.28,36.52 | v11.35,36.4 13.13,36.4 13.79,36.6 | 8.71,32.74 8.74,33.02 | v9.75,31.6 9.53,30.63 | v6.17,8.97 5.49,10.77 | 1.58,30.23 1.32,30.58
  Bottom 0.61: 24.99,22.58 25.02,22.1 | v24.31,21.41 23.85,21.18 23.9,21.01 | 17.22,30.48 17.67,30.19 | 17.67,30.19 17.8,30.1 | v17.07,30.43 17.67,30.19
  pour Bottom: -0.03,38.89 26.62,39.04 26.42,0.23 -0.23,0.08
I2CSCL  (via drill 0.33, 0.36)
  Top 0.178: 3.51,26.81 4.24,26.58
  Top 0.203: 3.66,25.12 4.14,25.04 IC$2.P$2
  Top 0.229: 2.16,25.12 3.66,25.12
  Top 0.254: 2.16,25.12 2.08,25.96 1.93,26.8 3.51,26.81 | 4.24,26.58 R4.2
  Top 0.406: IC$4.29 17.6,19.48 18.24,20.12 18.26,21.16 18.36,22 19.71,23.32 v20.07,23.57 | v1.93,26.87 2.06,26.16 2.08,25.96
  Bottom 0.292: 19.74,23.34 5.33,23.29
  Bottom 0.305: 5.33,23.29 5.05,23.57
  Bottom 0.406: 5.05,23.57 4.84,23.94 | 4.84,23.94 v1.93,26.87 | IC$3.18 11.6,8.21 10.24,8.66 7.47,8.64 7.44,9.17 7.42,13.13 4.88,15.29 3.86,15.29 2.44,16.71 2.44,21.54 4.84,23.94 | v20.07,23.57 20.04,23.57 19.74,23.34
I2CSDA  (via drill 0.33, 0.36)
  Top 0.165: 5.16,28.46 6.3,28.46
  Top 0.178: R2.2 5.16,28.46 | 6.3,28.46 6.83,27.58
  Top 0.229: 7.09,25.48 IC$2.P$10
  Top 0.254: 6.83,27.58 6.83,27.23 7.14,26.9 7.14,25.63 7.09,25.48 | 2.36,28.12 4.1,28.12 R2.2
  Top 0.305: v1.68,28.47 1.96,28.47 2.36,28.12
  Top 0.406: IC$4.30 17.36,20.28 17.58,20.5 17.6,22.02 19.05,23.5 v19.15,24.05
  Bottom 0.279: 1.92,16.43 1.9,25.2
  Bottom 0.305: v19.15,24.05 18.21,23.88 6.5,23.75 5.92,23.85 5.38,24.33
  Bottom 0.406: 5.38,24.33 v1.68,28.47 1.37,28.17 1.22,27.74 1.25,25.71 1.32,25.6 1.9,25.2 | IC$3.20 IC$3.19 10.93,7.59 10.52,7.92 6.93,7.92 6.86,8.28 6.84,9.8 6.5,10.34 6.25,12.85 5.03,14.07 4.06,14.07 1.92,16.43
INTEGCLR  (via drill 0.33, 0.36)
  Top 0.305: R11.1 v11.96,26.95 | Q2.1 v10.52,29.64 | 7.62,27.81 6.83,28.47 6.63,28.88 Q3.1
  Top 0.406: v2.16,13.72 6.15,13.74 v7.09,14.68 | v4.27,17.55 4.24,17.65 4.6,17.88 IC$4.14 | v7.57,27.94 7.62,27.81
  Bottom 0.254: 0.51,25.04 0.41,28.73 0.76,29.41 7.26,29.4 9.78,29.39
  Bottom 0.305: v11.96,26.95 10.09,28.93 | 10.09,28.93 9.78,29.39 | v7.57,27.94 7.26,29.4 | v10.52,29.64 10.09,28.93
  Bottom 0.381: 0.71,14.91 0.51,24.46
  Bottom 0.406: 0.51,24.46 0.51,25.04 | v2.16,13.72 1.93,13.69 0.71,14.91 | v7.09,14.68 7.11,16.61 v4.27,17.55
IOUT1
  Top 0.203: U$4.P$5 12.55,34.98 12.62,35.15
  Top 0.254: 3.53,38.59 3.4,37.19 IC$5.P$6 | 12.68,36.63 12.65,35.95
  Top 0.381: 12.68,38.23 12.68,36.63 12.62,35.15
  Top 0.394: 3.53,38.59 11.2,38.59 11.84,38.23
  Top 0.406: 11.84,38.23 12.68,38.23
IOUT2
  Top 0.229: 10.52,35.92 10.49,35.89 U$4.P$7
  Top 0.254: 6.1,38.03 5.87,37.21 IC$7.P$6 | 10.26,36.2 10.52,35.92
  Top 0.305: 8.92,38.03 9.07,37.57 9.07,36.2 10.26,36.2
  Top 0.394: 8.92,38.03 6.1,38.03
IOUT3
  Top 0.254: 11.74,33.6 11.56,33.48 U$4.P$2
  Top 0.406: 11.74,33.6 12.81,33.6 J4.1
IOUT4
  Top 0.203: 9.53,34.06 9.91,34.11 U$4.P$10
  Top 0.254: 9.55,33.78 9.53,34.06
  Top 0.356: 9.5,32.38 9.5,33.73
  Top 0.406: 9.5,33.73 9.55,33.78 | 9.5,32.38 10.64,32.38 11.48,32.79 11.91,32.87 J6.1
MEASURE1
  Top 0.254: U$4.P$3 13.19,34.13 13.49,34.09
  Top 0.356: 9.86,24.23 IC$4.6
  Top 0.368: 10.06,28.02 9.86,27.81
  Top 0.381: 13.49,34.09 13.49,31.52 | 9.86,27.81 9.86,24.23
  Top 0.406: 10.06,28.02 10.26,28.6 Q2.2 12.42,29.08 12.42,30.91 12.63,31.07 | 13.49,31.52 13.12,31.43 | 13.12,31.43 12.63,31.07 | C15.1 13.12,31.43 | TM1.TP 12.29,31.52 12.63,31.07
MEASURE2
  Top 0.254: 7.87,34.65 8.8,34.69 9.3,34.54 U$4.P$9 9.93,34.52 9.96,34.52 10,34.54
  Top 0.279: 2.36,30.71 4.32,30.71 C16.1
  Top 0.305: IC$4.8 8.2,25.25 8.48,25.65 | TM2.TP 2.36,30.71
  Top 0.381: 7.87,34.65 7.87,32.12 7.34,32.21
  Top 0.406: IC$4.8 | 8.48,25.65 8.48,27.08 8.45,27.71 8.64,29.29 8.69,29.44 8.76,30.12 8.41,30.99 7.82,30.99 | 7.82,30.99 7.87,32.12 | 7.82,30.99 Q3.2 | C16.1 5.51,31.85 5.74,32.21 7.34,32.21
MICOUT
  Top 0.356: 24.36,0.79 24.16,0.43 2.46,0.43 2.36,1.12 1.96,2.62 0.71,2.92 0.71,20.37
  Top 0.406: IC$4.10 1.88,21.08 0.71,20.37 | C1.2 14.2,4.17 15.67,4.17 16.48,4.55 18.24,4.55 19.07,4.44 22.89,4.44 24.87,3.63 24.36,0.79
N$1
  Top 0.254: IC$8.P$6 14.46,36.38 14.07,35.99
  Top 0.406: 14.07,35.99 14.07,34.44 14.12,34.11 14.25,33.24 J4.2
N$2
  Top 0.305: 17.25,38.05 17.3,36.39 IC$10.P$6 | 18.67,32.18 18.72,32.49 18.9,32.59 19.36,32.77
  Top 0.318: 18.67,31.09 18.67,31.47 18.65,31.09 18.67,32.18 | 19.36,32.77 19.56,33.6
  Top 0.356: 19.56,37.52 19.51,38.05 17.25,38.05
  Top 0.381: 18.28,31.01 18.65,31.09
  Top 0.406: 19.56,33.6 19.56,37.52 | 18.28,31.01 17.83,31.01 17.6,31.04 16.89,31.5 15.7,31.52 14.68,32.28 J6.2
N$3
  Top 0.406: R8.1 C15.2 Q2.3
N$4
  Top 0.406: IC$1.3 J1.1 23.39,24.49 IC$1.1
N$5
  Top 0.406: R16.1 11.06,8.4 10.92,8.25 11.05,8.36 IC$9.5
N$6
  Top 0.406: C16.2 5,30.3 6.63,30.3 Q3.3
  Top 0.61: R9.1 C16.2
N$7
  Top 0.152: 3.89,23.52 3.89,24.21 4.56,24.21
  Top 0.178: 3.91,23.42 3.89,23.52
  Top 0.203: IC$2.P$4 4.56,24.21
  Top 0.254: C8.2 4.65,22.76 4.52,22.66 4.32,23.11 4.17,23.29 4.04,23.29 3.99,23.32 3.91,23.42
N$8  (via drill 0.33)
  Top 0.305: IC$4.2 v13.01,25.65 | v19.46,27.79 Y1.3
  Bottom 0.305: v13.01,25.65 14.17,27.86 18.47,27.86 v19.46,27.79
N$9  (via drill 0.33)
  Top 0.305: R6.2 14.43,22.3 v14.33,21.29 | v12.93,21.62 12.19,22.25 IC$4.3
  Bottom 0.305: v14.33,21.29 v12.93,21.62
N$10
  Top 0.61: L1.1 23.11,28.11 IC$1.5
N$11  (via drill 0.33)
  Top 0.254: R6.1 15.24,24 15.57,23.67 16.79,23.67 17.12,23.85 v17.14,24.51
  Top 0.305: v16.51,25.86 Y1.1
  Bottom 0.305: v17.14,24.51 17.07,25.32 v16.51,25.86
N$12
  Bottom 0.406: IC$3.27 5.28,7.11 4.78,7.52 C11.2
N$14
  Top 0.406: C1.1 U$1.P$1
N$15
  Bottom 0.406: IC$3.2 22.81,4.42 22.5,3.91 22.5,1.92 23.8,1.92 23.9,2.11 23.93,2.18 23.93,2.87 C5.2
N$16
  Bottom 0.381: 24.11,1.36 21.95,1.36
  Bottom 0.406: C5.1 24.38,1.55 24.11,1.36 | 21.95,1.36 21.95,4.17 IC$3.3
N$19
  Bottom 0.406: R10.2 2.21,10.57 3.4,10.11 4.96,10.03 5.26,9.68 5.38,9.39 5.51,7.72 5.99,7.29 IC$3.26
N$24
  Bottom 0.305: 20.78,3.35 20.75,2.24 20.3,2.04 19.18,1.93
  Bottom 0.356: 20.78,3.35 20.68,4.22 | 19.18,1.93 18.01,1.91 C6.1
  Bottom 0.406: IC$3.5 20.68,4.22
N$27
  Bottom 0.343: 21.37,1.77 20.8,1.71 20.14,1.45
  Bottom 0.356: IC$3.4 21.37,3.86 21.37,1.77 | C6.2 19.38,1.3 20.14,1.45
N$30
  Bottom 0.406: IC$3.28 4.62,6.63 4.37,6.93 1.22,6.93 C12.2
NRST  (via drill 0.33)
  Top 0.279: 11.38,25.88 11.51,26.27 | 13.67,26.44 13.67,27.79
  Top 0.292: 11.51,26.27 13.64,26.27
  Top 0.305: U1.ID 17.59,11.45 17.12,11.51 17.12,13.59 17.02,13.69 16.69,13.72 v16.41,13.61 | v12.17,20.88 11.43,21.44 IC$4.4 | 13.64,26.27 13.67,26.44 | 13.67,27.79 15.52,27.79 R5.1
  Top 0.406: IC$4.4 11.38,25.88 | 15.51,27.28 R5.1
  Bottom 0.305: 16.03,13.74 v16.41,13.61 15.67,13.82 12.55,17.53 12.57,20.3 v12.17,20.88
PBI$1  (via drill 0.33, 0.36)
  Top 0.178: 10.12,12.48 10.54,12.62 11.96,12.62 12.19,12.93 IC$4.22
  Top 0.254: 10.12,12.48 9.6,11.96 8.51,11.96 v8.15,11.99 | 12.13,3.76 D4.A 12.34,3.36
  Top 0.406: v8.13,9.58 8.05,9.04 8.28,8.87 9.68,5.49 9.67,3.76 12.13,3.76 | 12.34,3.36 12.95,3.12 v13.77,2.79
  Bottom 0.254: S$3.P$1 12.75,3.38 13.89,3.38 | 13.89,3.38 S$3.P$2 | v13.77,2.79 13.89,3.38
  Bottom 0.406: v8.13,9.58 v8.15,11.99
PBI$2  (via drill 0.33, 0.36)
  Top 0.254: IC$4.19 9.8,12.95 9.25,12.39 8.89,12.39 8.71,12.62 7.47,12.62 6.22,11.1 6.22,9.63 5.26,9.63 v4.67,9.04 | 18.87,2.29 18.92,2.36
  Top 0.305: v19.91,2.66 21.08,2.64 21.79,2.67 v23.19,2.61
  Top 0.406: v7.62,3.79 7.67,2.82 | 7.67,2.82 5.87,3.2 3.51,5.21 1.55,5.21 1.55,8.41 v3,8.69 | 18.87,2.29 18.49,1.42 18.03,1.3 13.36,1.32 D4.C 11.35,1.19 8.23,1.19 7.67,1.6 7.67,2.82 | 18.92,2.36 v19.15,2.64
  Bottom 0.178: v19.15,2.64 19.33,3.2 19.71,3.2 S$2.P$1
  Bottom 0.254: S$1.P$1 S$1.P$2 v7.62,3.79 | S$2.P$1 v19.91,2.66 | v23.19,2.61 S$2.P$2 | v4.67,9.04 v3,8.69
PIEZONEG  (via drill 0.33)
  Top 0.305: v13.72,18.82 12.75,18.85 10.62,18.82 9.53,18.54 v9.53,17.83 9.55,17.02 9.55,15.95 9.93,15.62 10.39,15.21 10.62,15.09 IC$4.20
  Top 0.406: IC$4.13 4.8,18.69 v4.29,18.57
  Bottom 0.305: v9.53,17.83 8.36,16.87 7.77,16.92 6.48,17.58 v4.29,18.57
  Bottom 0.406: v13.72,18.82 14.33,18.72 15.06,18.87 15.72,19.36 18.62,19.36 U$2.P$1
PIEZOPOS  (via drill 0.33)
  Top 0.305: v13.18,17.98 12.62,18.35 10.72,18.35 10.19,18.14 10.16,17.58 v10.19,16.71 10.26,15.98 10.54,15.7 11.07,15.7 11.41,15.47 IC$4.21
  Top 0.406: v21.41,28.42 R3.1 | IC$4.12 4.93,19.51 v4.42,19.38
  Bottom 0.305: 14.02,19.94 16,21.62 21.89,21.88 22.15,27.45 v21.41,28.42 | v14.02,19.81 13.03,19.43 13.03,18.19 v13.18,17.98 | v4.42,19.38 6.81,18.49 8.08,18.44 9.58,18.47 10.21,18.46 v10.19,16.71
  Bottom 0.406: v14.02,19.81 14.02,19.94
SCRPWR  (via drill 0.33)
  Top 0.356: IC$4.7 8.99,22.48 v11.3,20.24
  Bottom 0.356: v11.3,20.24 10.85,18.57 10.85,16.08
  Bottom 0.406: 10.85,16.08 15.82,9.73 17.17,9.75 17.22,10.46 17.2,12.22 Q1.P$2 17.55,14.58 R7.1
SCRRES  (via drill 0.33)
  Top 0.406: IC$4.18 9.04,13.99 v8.93,16.26
  Bottom 0.406: IC$3.14 14.4,9.1 9.12,14.38 v8.93,16.26
SCRVREG  (via drill 0.33)
  Top 0.406: 18.95,6.68 19.41,6.88 | 19.41,6.88 19.61,6.96 v19.63,7.8 | 19.41,6.88 18.69,6.63 18.54,6.16 | 18.54,6.16 U$1.P$4 | C7.2 17.04,7.16 17.17,6.78 18.54,6.16
  Bottom 0.381: 17.88,4.42 17.53,4.09 16.94,4.09 16.51,4.5
  Bottom 0.406: 20,4.35 IC$3.6 20.07,6.73 v19.63,7.8 19,9.3 | 17.88,4.42 17.88,5.5 IC$3.9 17.83,5.33 | 16.51,4.5 16.51,5.51 IC$3.11 16.54,6.68 | Q1.P$1 18.57,10.95 18.87,9.78 19,9.3 | 17.91,7.14 17.83,5.33 | 17.83,5.33 17.86,8.79 19,9.3
SWDCLK/USBD+  (via drill 0.33, 0.36)
  Top 0.305: U1.D+ 16.92,10.74 v16.48,10.64 | v11.49,16.89 13.08,16.84 13.82,15.16 13.82,14.04 IC$4.24
  Bottom 0.305: v16.48,10.64 16.43,11.28 v11.49,16.89
SWDIO/USBD-  (via drill 0.33, 0.36)
  Top 0.305: v11.93,17.73 10.85,17.7 10.85,16.26 12.68,16.23 12.98,15.57 12.98,14.06 IC$4.23
  Top 0.406: 19.42,10.11 U1.D- 17.69,10.13 17.14,9.93 15.72,9.91 15.72,11.1 16.36,11.71 v16.33,12.72 | R1.2 v23.19,19.79
  Bottom 0.305: v16.33,12.72 17.09,13.03 17.09,14.15 16.97,14.22 16.79,14.28 16.18,14.28 15.06,15.39 15.75,16.57 16.93,16.91 | v16.33,12.72 16.21,12.67 | v11.93,17.73 12.18,17.15 12.39,16.74 15.62,13.03 v16.33,12.72
  Bottom 0.406: 15.77,16.49 16.93,16.91 21.84,16.89 23.9,16.66 v23.19,19.79
VBAT
  Top 0.203: D2.P$1 20.98,23.04
  Top 0.254: 20.98,23.04 20.88,22.73
  Top 0.406: C22.1 10.36,11.58 11,12.17 13.54,12.17 13.79,11.99 13.79,10.62 IC$9.3
  Top 0.559: 17.93,16.97 19.13,18.19
  Top 0.61: 13.54,12.17 14.58,12.29 14.58,15.06 14.71,15.62 17.32,15.62 17.91,16 17.93,16.97 | 20.88,22.73 20.02,22.56 19.13,21.82 19.13,18.19 | C22.1 9.04,11.18 8.2,11.18 6.99,9.91 6.99,9.3 7.24,8.89 7.49,8.66 U$3.P$2
VCC  (via drill 0.36)
  Top 0.203: D3.P$2 D2.P$2 20.97,24.03
  Top 0.356: J1.2 26.19,24.71
  Top 0.381: 26.19,24.71 26.19,29.41 25.4,30.18 24.04,30.44
  Top 0.406: C20.2 24.77,31.58 IC$6.3 24.14,30.54 24.04,30.44 23.77,30.18 22.4,30.18 | 22.4,30.18 22.28,30.3 22.28,30.92 | 22.28,30.92 22.28,31.2 IC$6.1 22.28,30.92 | R14.1 3.23,17.76 v3.78,16.61 | 20.78,24.74 v20.8,25.58 20.83,24.36 20.97,24.03 22.05,24.03 | C3.2 22.25,28.6 22.4,29.08 22.4,30.18 | 22.05,24.03 22.25,24.03 23.29,23.72 23.47,23.22 23.47,20.6 23.93,20.55 23.93,19.25 | 23.93,19.25 26.11,19.48 26.21,21.62 26.21,23.04 J1.2 | R1.1 21.11,18.87 22.86,18.85 23.5,18.87 23.8,18.95 23.93,19.25 | TP1.TP 22.05,24.03
  Bottom 0.406: v20.8,25.58 20.78,25.45 20.83,22.78 7.01,22.78 3.4,19.69 3.23,18.02 v3.78,16.61
VREG  (via drill 0.36)
  Top 0.203: 4.13,25.47 IC$2.P$1 | 4.6,25.5 5.46,25.43
  Top 0.229: 7.73,22.81 7.73,24.61 IC$2.P$8
  Top 0.254: 5.51,25.32 6.42,26.23 R4.1 6.01,26.99 | 5.51,25.32 5.59,24.77 5.87,24.64 | 5.87,24.64 IC$2.P$8 | R2.1 6.01,26.99 | 5.79,24.56 5.87,24.64 | C4.2 4.13,25.47 | 5.51,25.32 5.59,25.3 5.46,25.43 | C9.1 3.34,27.51 4.01,27.04 5.72,27.03 6.01,26.99 | 8.21,15.54 8.21,15.77 8.33,15.98 8.33,16.74 8.66,16.99 8.84,17.04 | 10.57,19.48 10.57,20.04 8.03,22.58 7.73,22.81 | IC$2.P$1 4.6,25.44 4.6,25.5
  Top 0.292: 20.93,26.95 23.45,26.95
  Top 0.305: IC$4.17 8.21,15.54 | 13.82,24.12 IC$4.1
  Top 0.356: 25.63,27.18 25.43,27.31 IC$1.4 24.76,27.76 24.38,27.76 24.16,27.53 24.16,27.25 23.85,26.95 23.45,26.95 | C2.1 25.45,23.67 25.45,24.64 25.63,24.97
  Top 0.381: 25.63,24.97 25.63,26.26
  Top 0.406: 25.63,27.18 25.63,26.26 | IC$4.17 6.37,12.34 C19.1 C17.1 | 15.67,25.27 15.11,25.32 13.8,25.28 IC$4.1 13.79,22.25 13.61,21.54 13.61,20.7 12.65,19.48 10.57,19.48 8.84,18.95 8.84,17.04 | C10.2 16.37,25.14 16.38,25.18 17.48,25.18 17.68,25.5 17.68,28.56 20.6,28.56 20.93,26.95
  Top 0.61: L1.2 24.92,28.21 IC$1.4 | R5.2 15.6,25.54 15.67,25.27 C10.2 | C2.1 25.48,21.55 25.35,20.62 v24.61,20.3
  Bottom 0.318: Q1.P$3 18.75,13.28
  Bottom 0.406: R7.2 19,16.07
  Bottom 0.61: v24.61,20.3 24.49,19.03 24.66,15.87 22,16.14 20.83,16.12 20.03,16.12 19,16.07 18.71,13.96 18.75,13.28
VUSB
  Top 0.203: D3.P$1 21.95,23.06
  Top 0.254: 21.95,23.06 21.95,22.78
  Top 0.295: 9.02,10.57 11.01,10.57
  Top 0.305: 9.02,10.57 8.94,9.68
  Top 0.356: U1.VBUS 17.53,9.47 16.79,9.24
  Top 0.406: 19.51,9.47 U1.VBUS | C23.2 11.3,11.25 10.92,11.2 10.92,10.65 IC$9.4 11.01,10.57
  Top 0.61: 8.94,9.68 8.97,9.04 10.29,6.1 14.88,6.1 14.88,9.16 | 16.79,9.24 14.88,9.16 | 14.88,9.16 16.59,9.22 15.47,9.22 15.27,9.17 14.88,9.42 14.88,11.38 15.47,11.91 15.47,14.1 15.49,14.86 17.83,14.86 18.72,15.44 18.72,16.7 19.91,17.89 19.99,18.42 19.94,18.47 19.94,21.44 20.3,21.74 21.41,21.77 21.95,22.12 21.95,22.78

### Text on the board
tDocu: No top layer components left of this line